# EAGLE design Voltage regulator board (EAGLE 9.0.1)
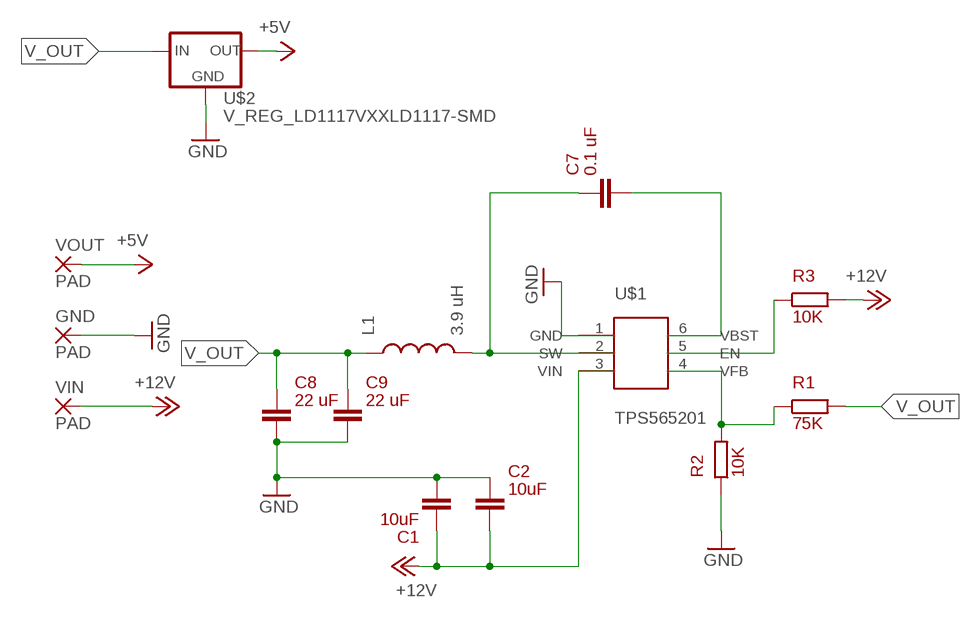
[diagram p0: schematic, sheet 1]

## Parts
C1  10uF  1206CAPACITOR  [C1206K]
C2  10uF  1206CAPACITOR  [C1206K]
C7  0.1 uF  1206CAPACITOR  [C1206K]
C8  22 uF  1206CAPACITOR  [C1206K]
C9  22 uF  1206CAPACITOR  [C1206K]
GND  PAD  [PAD]
L1  3.9 uH  SRN6028  [SRN6028]
R1  75K  0603RESISTOR  [C0603K]
R2  10K  0603RESISTOR  [C0603K]
R3  10K  0603RESISTOR  [C0603K]
U$1  TPS565201  [SOT23-6]
U$2  V_REG_LD1117VXXLD1117-SMD  [SOT223]
VIN  PAD  [PAD]
VOUT  PAD  [PAD]

## Nets
+5V: U$2.2(OUT) VOUT.1(P)
+12V: C1.1 C2.2 R3.2 U$1.3(VIN) VIN.1(P)
GND: C1.2 C2.1 C8.2 C9.2 GND.1(P) R2.1 U$1.1(GND) U$2.1(GND)
N$1: C7.1 L1.P$2 U$1.2(SW)
N$2: R1.1 R2.2 U$1.4(VFB)
N$3: R3.1 U$1.5(EN)
N$4: C7.2 U$1.6(VBST)
V_OUT: C8.1 C9.1 L1.P$1 R1.2 U$2.3(IN)

## Library data of the parts
C1 C2 C7-C9 = RoboSoccer:1206CAPACITOR
GND VIN VOUT = RoboSoccer:PAD
L1 = RoboSoccer:SRN6028
R1-R3 = RoboSoccer:0603RESISTOR
U$1 = RoboSoccer:TPS565201
U$2 = SparkFun-IC-Power:V_REG_LD1117VXX: LD1117VXX voltage regulator. We carry the 3.3V version (COM-00526) in TO-220 package.; PROD_ID: VREG-13917

## Board
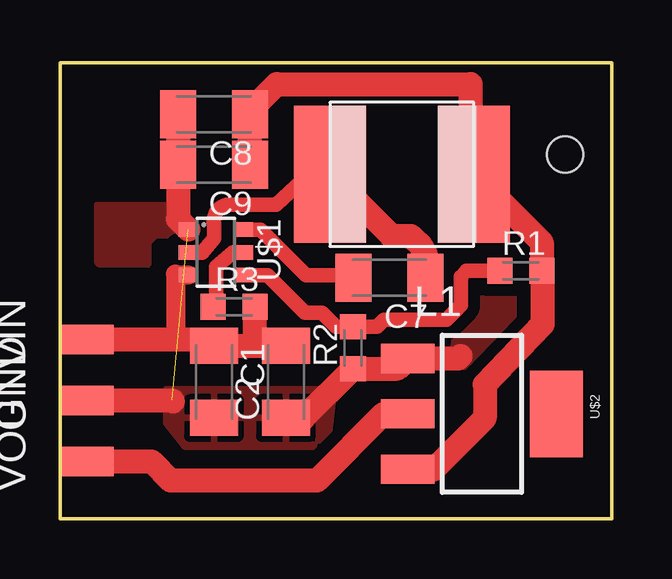
[diagram p1: board, top side]

Size 23 x 19 mm. Coordinates in mm from the lower left corner, seen from the top.
Outline: 0,0 0,19 23,19 23,0 0,0
Copper layers (1*16): Top 0.035mm / dielectric 1.5mm / Bottom 0.035mm
Design rules "default *": minimum track width 6mil, minimum drill 0.35mm, track to track 0.5mm, track to pad 6mil, pad to pad 6mil, via to via 6mil, smd to smd 6mil, copper to edge 0.3mm, drill to drill 6mil, minimum pad ring 10mil, minimum via ring 8mil, stop-mask expansion 4mil, vias tented up to drill 0mil, thermal gap 10mil
Holes 1.5 mm at 21.05,15.19

### Footprints (pad centres in the part's own frame; a part is rotated, then mirrored left to right if it is on the bottom)
C1206K = smd 1.5 x 2: 1 -1.5,0; 2 1.5,0
PAD = smd 1.219 x 2.235: 1 0,0
SRN6028 = smd 3 x 5.7: P$1 1.5,2.85; P$2 7.5,2.85
C0603K = smd 1.05 x 1.08: 1 -0.875,0; 2 0.875,0
SOT23-6 = smd 0.6 x 0.8: 1 -0.95,-1.15; 2 0,-1.15; 3 0.95,-1.15; 4 0.95,1.15; 5 0,1.15; 6 -0.95,1.15
SOT223 = smd 1.219 x 2.235: 1 -2.311,-3.099; 2 0,-3.099; 3 2.311,-3.099 | smd 3.6 x 2.2: 4 0,3.099

### Placement (x,y rotation side)
C1  6.4,5.71 270 top
C2  9.4,5.71 90 top
C7  13.72,10.06 180 top
C8  6.4,16.86 180 top
C9  6.4,14.76 180 top
GND  1.1,4.94 90 top
L1  18.74,17.21 180 top
R1  19.2,10.34 0 top
R2  12.2,7.14 90 top
R3  7.24,8.84 0 top
U$1  6.48,11.11 270 top
U$2  17.58,4.38 270 top
VIN  1.1,7.48 90 top
VOUT  1.1,2.4 90 top

### Tracks (layer width: path | path; a pad name or v marks a point on that pad's centre or on a via)
+5V
  Top 0.8: U$2.2 13.48,4.38
  Top 1: 13.48,4.38 10.7,1.6 4.6,1.6 3.8,2.4 VOUT.1
+12V
  Top 0.8: U$1.3 4.84,10.16 4.8,10.2 4.8,7.58 4.7,7.48
  Top 1: VIN.1 4.7,7.48 6.13,7.48 C1.1 8.1,7.21 | 8.1,7.21 C2.2 | 8.1,7.21 8.12,7.22 R3.2
GND  (1 unrouted)
  Top 0.6: R2.1 12.34,6.4 13.7,6.4
  Top 1: C8.2 C9.2 4.9,12.49 U$1.1 | GND.1 4.66,4.94 4.7,4.9 | C2.1 10.14,4.21 R2.1 14.05,6.26 U$2.1 16.59,6.69 16.7,6.8
  pour Top: 4.4,5.4 11.4,5.4 11.2,3.6 10.6,3 5.2,3 4.4,4
  pour Top (no thermals): 1.5,12.5 1.5,10.7 1.6,10.6 3.7,10.6 3.7,11.5 4,11.8 5.5,11.8 5.1,12.2 5.1,13 5,13.1 1.5,13.1
  pour Top: 14.7,6.7 16.3,6.7 16.4,7.4 17.5,8.5 17.5,9.3 18.9,9.3 18.9,7.8 17.3,6.3 14.7,6.3
N$1
  Top 0.6: U$1.2 5.9,11.1 6.4,11.7 6.4,12.3 arc-90 7,13.1 9,13.1 10.36,14.36 L1.P$2
  Top 1: L1.P$2 13.8,11.8 14.6,11.8 15.09,11.31 15.09,11.24 15.22,11.11 C7.1
N$2
  Top 0.6: U$1.4 8.64,10.16 10.2,8.6 10.9,8.6 11.48,8.02 R2.2 12.98,8.02 13,8 13.2,8 13.5,8.3 16.1,8.3 16.7,8.9 16.7,10.1 16.94,10.34 R1.1
N$3
  Top 0.6: R3.1 6.5,9.28 6.5,10.5 7.21,11.11 U$1.5
N$4
  Top 0.6: C7.2 12.12,10.16 10.24,10.16 8.34,12.06 U$1.6
V_OUT
  Top 0.6: L1.P$1 17.5,14.1 17.8,14.1
  Top 1: C9.1 C8.1 7.9,17 9.02,18.12 17.1,18.12 17.1,14.5 L1.P$1 20.07,11.53 R1.2 20.1,10.31 20.1,8.1 17.7,5.6 17.7,4.2 15.57,2.07 U$2.3